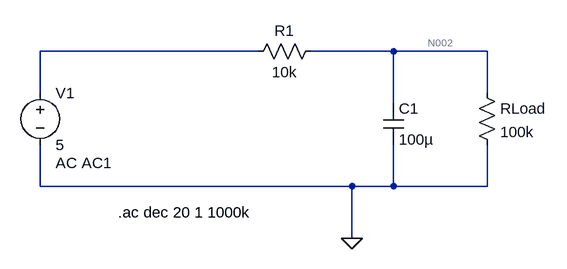
[diagram p0: schematic schemat.asc]
schemat.asc, the LTspice schematic file:
Version 4
SHEET 1 880 680
WIRE 192 -16 -144 -16
WIRE 400 -16 272 -16
WIRE 544 -16 400 -16
WIRE -144 48 -144 -16
WIRE 544 48 544 -16
WIRE 400 64 400 -16
WIRE -144 192 -144 128
WIRE 336 192 -144 192
WIRE 400 192 400 128
WIRE 400 192 336 192
WIRE 544 192 544 128
WIRE 544 192 400 192
WIRE 336 272 336 192
FLAG 336 272 0
SYMBOL voltage -144 32 R0
WINDOW 123 24 124 Left 2
WINDOW 39 0 0 Left 0
SYMATTR InstName V1
SYMATTR Value 5
SYMATTR Value2 AC AC1
SYMBOL cap 384 64 R0
SYMATTR InstName C1
SYMATTR Value 100µ
SYMBOL res 288 -32 R90
WINDOW 0 0 56 VBottom 2
WINDOW 3 32 56 VTop 2
SYMATTR InstName R1
SYMATTR Value 10k
SYMBOL res 528 32 R0
SYMATTR InstName RLoad
SYMATTR Value 100k
TEXT -24 232 Left 2 !.ac dec 20 1 1000k

The netlist it stands for:
* schemat.asc
V1 N001 0 5 AC AC1
C1 N002 0 100µ
R1 N002 N001 10k
RLoad N002 0 100k
.ac dec 20 1 1000k
.backanno
.end

* Results of the author's LTspice run, read from the files saved beside the schematic
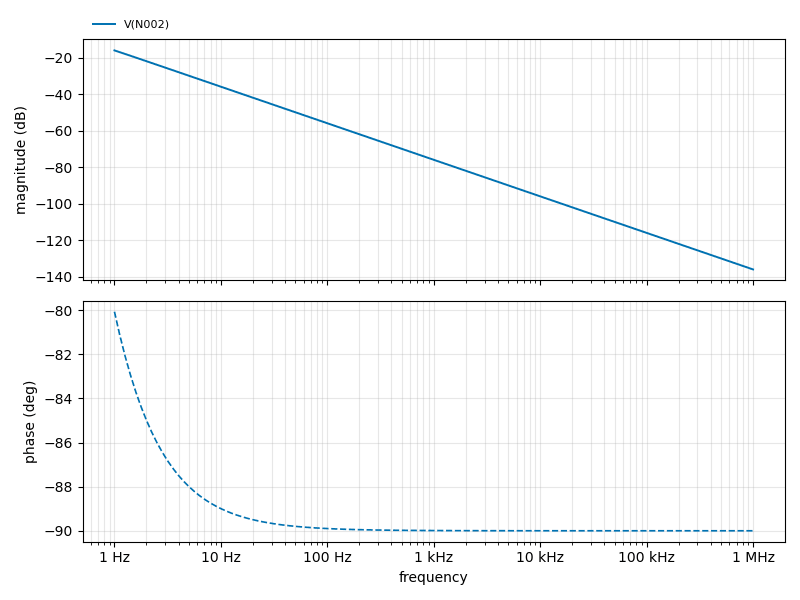
[diagram p1: AC Analysis of schemat.asc, plotted from the saved traces]
* AC Analysis, 1 run:
*   V(N002): -16.09 dB at 1 Hz, -135.96 dB at 1 MHz, peak -16.09 dB at 1 Hz, 3 dB below the peak at 1.425 Hz